# Altium schematic sheet Sheet1.SchDoc
size A4; SheetNumber: 1; SheetTotal: 1
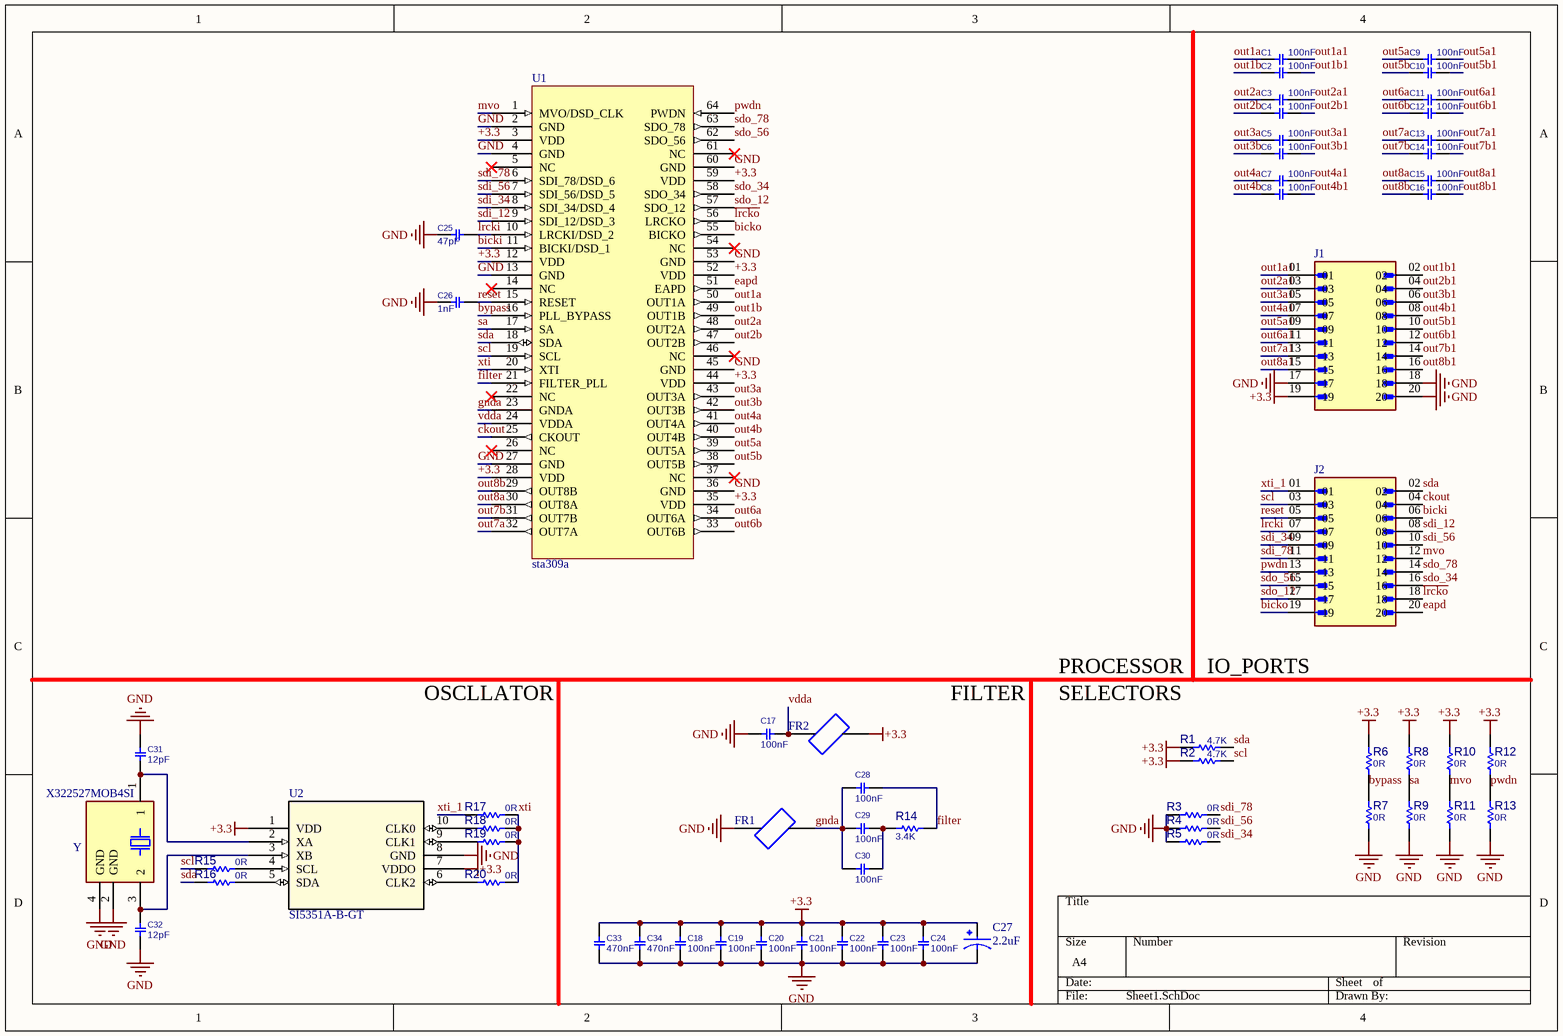
[diagram p0: Sheet1.SchDoc]

## Parts
C1  100nF  [C0603]
C2  100nF  [C0603]
C3  100nF  [C0603]
C4  100nF  [C0603]
C5  100nF  [C0603]
C6  100nF  [C0603]
C7  100nF  [C0603]
C8  100nF  [C0603]
C9  100nF  [C0603]
C10  100nF  [C0603]
C11  100nF  [C0603]
C12  100nF  [C0603]
C13  100nF  [C0603]
C14  100nF  [C0603]
C15  100nF  [C0603]
C16  100nF  [C0603]
C17  100nF  [C0603]
C18  100nF  [C0603]
C19  100nF  [C0603]
C20  100nF  [C0603]
C21  100nF  [C0603]
C22  100nF  [C0603]
C23  100nF  [C0603]
C24  100nF  [C0603]
C25  47pF  [C0603]
C26  1nF  [C0603]
C27  2.2uF  [CAPMP3216X180N]
C28  100nF  [C0603]
C29  100nF  [C0603]
C30  100nF  [C0603]
C31  12pF  [C0603]
C32  12pF  [C0603]
C33  470nF  [C0603]
C34  470nF  [C0603]
FR1  MI0805K400R-10  [FB_MI0805K400R-10]  (value not drawn)
FR2  MI0805K400R-10  [FB_MI0805K400R-10]  (value not drawn)
J1  VMHD-2x10-150-095-030  [VALCON_VMHD-2x10-150-095-030]  (value not drawn)
J2  VMHD-2x10-150-095-030  [VALCON_VMHD-2x10-150-095-030]  (value not drawn)
R1  4.7K  [R0603]
R2  4.7K  [R0603]
R3  0R  [R0603]
R4  0R  [R0603]
R5  0R  [R0603]
R6  0R  [R0603]
R7  0R  [R0603]
R8  0R  [R0603]
R9  0R  [R0603]
R10  0R  [R0603]
R11  0R  [R0603]
R12  0R  [R0603]
R13  0R  [R0603]
R14  3.4K  [R0603]
R15  0R  [R0603]
R16  0R  [R0603]
R17  0R  [R0603]
R18  0R  [R0603]
R19  0R  [R0603]
R20  0R  [R0603]
U1  sta309a  [QFP50P1200X1200X120-64N]
U2  SI5351A-B-GT  [10MSOP_3X3_SIL]
Y  X322527MOB4SI  [XTAL_TSX-3225_16.0000MF18X-AC3]

## Nets
+3.3: C18.2 C19.2 C20.2 C21.2 C22.2 C23.2 C24.2 C27.1 C33.2 C34.2 FR2.1 J1.19 R1.1 R2.1 R6.1 R8.1 R10.1 R12.1 U1.3(VDD) U1.12(VDD) U1.28(VDD) U1.35(VDD) U1.44(VDD) U1.52(VDD) U1.59(VDD) U2.1(VDD) U2.7(VDDO)
GND: C17.1 C18.1 C19.1 C20.1 C21.1 C22.1 C23.1 C24.1 C25.2 C26.2 C27.2 C31.2 C32.2 C33.1 C34.1 FR1.1 J1.17 J1.18 J1.20 R3.1 R4.1 R5.1 R7.1 R9.1 R11.1 R13.1 U1.2(GND) U1.4(GND) U1.13(GND) U1.27(GND) U1.36(GND) U1.45(GND) U1.53(GND) U1.60(GND) U2.8(GND) Y.2(GND) Y.4(GND)
~{lrcko}: J2.18 U1.56(LRCKO)
bicki: J2.06 U1.11(BICKI/DSD_1)
bicko: J2.19 U1.55(BICKO)
bypass: R6.2 R7.2 U1.16(PLL_BYPASS)
ckout: J2.04 U1.25(CKOUT)
eapd: J2.20 U1.51(EAPD)
filter: C28.1 R14.2 U1.21(FILTER_PLL)
gnda: C28.2 C29.2 C30.2 FR1.2 U1.23(GNDA)
lrcki: C25.1 J2.07 U1.10(LRCKI/DSD_2)
mvo: J2.12 R10.2 R11.2 U1.1(MVO/DSD_CLK)
out1a: C1.1 U1.50(OUT1A)
out1a1: C1.2 J1.01
out1b: C2.1 U1.49(OUT1B)
out1b1: C2.2 J1.02
out2a: C3.1 U1.48(OUT2A)
out2a1: C3.2 J1.03
out2b: C4.1 U1.47(OUT2B)
out2b1: C4.2 J1.04
out3a: C5.1 U1.43(OUT3A)
out3a1: C5.2 J1.05
out3b: C6.1 U1.42(OUT3B)
out3b1: C6.2 J1.06
out4a: C7.1 U1.41(OUT4A)
out4a1: C7.2 J1.07
out4b: C8.1 U1.40(OUT4B)
out4b1: C8.2 J1.08
out5a: C9.1 U1.39(OUT5A)
out5a1: C9.2 J1.09
out5b: C10.1 U1.38(OUT5B)
out5b1: C10.2 J1.10
out6a: C11.1 U1.34(OUT6A)
out6a1: C11.2 J1.11
out6b: C12.1 U1.33(OUT6B)
out6b1: C12.2 J1.12
out7a: C13.1 U1.32(OUT7A)
out7a1: C13.2 J1.13
out7b: C14.1 U1.31(OUT7B)
out7b1: C14.2 J1.14
out8a: C15.1 U1.30(OUT8A)
out8a1: C15.2 J1.15
out8b: C16.1 U1.29(OUT8B)
out8b1: C16.2 J1.16
pwdn: J2.13 R12.2 R13.2 U1.64(PWDN)
reset: C26.1 J2.05 U1.15(RESET)
sa: R8.2 R9.2 U1.17(SA)
scl: J2.03 R2.2 R15.1 U1.19(SCL)
sda: J2.02 R1.2 R16.1 U1.18(SDA)
sdi_12: J2.08 U1.9(SDI_12/DSD_3)
sdi_34: J2.09 R5.2 U1.8(SDI_34/DSD_4)
sdi_56: J2.10 R4.2 U1.7(SDI_56/DSD_5)
sdi_78: J2.11 R3.2 U1.6(SDI_78/DSD_6)
sdo_12: J2.17 U1.57(SDO_12)
sdo_34: J2.16 U1.58(SDO_34)
sdo_56: J2.15 U1.62(SDO_56)
sdo_78: J2.14 U1.63(SDO_78)
vdda: C17.2 FR2.2 U1.24(VDDA)
xti: R17.2 R18.2 R19.2 R20.2 U1.20(XTI)
xti_1: J2.01 R17.1
NetC29_1: C29.1 C30.1 R14.1
NetC31_1: C31.1 U2.2(XA) Y.1
NetC32_1: C32.1 U2.3(XB) Y.3(2)
NetR15_2: R15.2 U2.4(SCL)
NetR16_2: R16.2 U2.5(SDA)
NetR18_1: R18.1 U2.10(CLK0)
NetR19_1: R19.1 U2.9(CLK1)
NetR20_1: R20.1 U2.6(CLK2)

Not connected (* = marked no-connect by the designer): U1 5(NC)* 14(NC)* 22(NC)* 26(NC)* 37(NC)* 46(NC)* 54(NC)* 61(NC)*

## Notes on the sheet
- OSCLLATOR
- FILTER
- PROCESSOR
- SELECTORS
- IO_PORTS

## Library data of the parts
C1-C26 C28-C34 = CAP_SMD_MLCC_0603_1: CAP, MLCC; PARAM: -, -%; MANF_P#: MANF_PART#; PARAM2: -V; PRICE: 100= 1$; MANF: -; ASSEMBLY: ASSEMBLY
  C1-C24 C28-C30: VALUE: 100nF
  C25: VALUE: 47pF
  C26: VALUE: 1nF
  C31 C32: VALUE: 12pF
  C33 C34: VALUE: 470nF
C27 = T491A475K010AT: Capacitors Tantalum PCB 4.7uF SMD Tol 10% 10 VDC Case Size 3216 T491 Series | KEMET T491A475K010AT; SnapEDA_Link: https://www.snapeda.com/parts/T491A475K010AT/KEMET/view-part/?ref=snap; Package: SMD-2 KEMET; Value: *; MF: KEMET; MP: T491A475K010AT; Check_prices: https://www.snapeda.com/parts/T491A475K010AT/KEMET/view-part/?ref=eda
FR1 FR2 = MI0805K400R-10: 40 Ohms @ 100MHz 1 Power Line Ferrite Bead 0805 (2012 Metric) 1.5A 50mOhm; MF: Laird-Signal Integrity Products; Availability: Warning; SnapEDA_Link: https://www.snapeda.com/parts/MI0805K400R-10/Laird/view-part/4794545/?ref=snap; MP: MI0805K400R-10; Value: *; Price: None; Package: 0805 Laird-Signal Integrity Products; Purchase-URL: https://pricing.snapeda.com/search/part/MI0805K400R-10/?ref=eda; Check_prices: https://www.snapeda.com/parts/MI0805K400R-10/Laird/view-part/4794545/?ref=eda
R1-R20 = RES_SMD_0603_1: RESISTOR, SMD; PARAM: 1%, 0.1W; DESC: DESCRIPTION; DIST#: MOUSER; MANF_P#: -; MANF: -; ASSEMBLY: ASSEMBLY; PRICE: -; PARAM2: -
  R1 R2: VALUE: 4.7K
  R3-R13 R15-R20: VALUE: 0R
  R14: VALUE: 3.4K
U2 = SI5351A-B-GT: No Description Available; Manufacturer_Name: Silicon Labs; Copyright: Copyright (C) 2025 Ultra Librarian. All rights reserved.; Manufacturer_Part_Number: SI5351A-B-GT; RefDes: RefDes; Type: Type
Y = TSX-3225_16.0000MF18X-AC3: 16 MHz Â±10ppm Crystal 18pF 60 Ohms 4-SMD, No Lead; MF: EPSON; MP: TSX-3225 16.0000MF18X-AC3; SnapEDA_Link: https://www.snapeda.com/parts/TSX-3225%2016.0000MF18X-AC3/EPSON/view-part/?ref=snap; Package: SMD-4 EPSON; Value: *; Check_prices: https://www.snapeda.com/parts/TSX-3225%2016.0000MF18X-AC3/EPSON/view-part/?ref=eda
J1 J2 = VMHD-2x10-150-095-030: Availability: Unavailable; MP: VMHD-2x10-150-095-030; Package: None; Price: None; Value: *